# EAGLE schematic knxLayout (EAGLE 6.6.0)
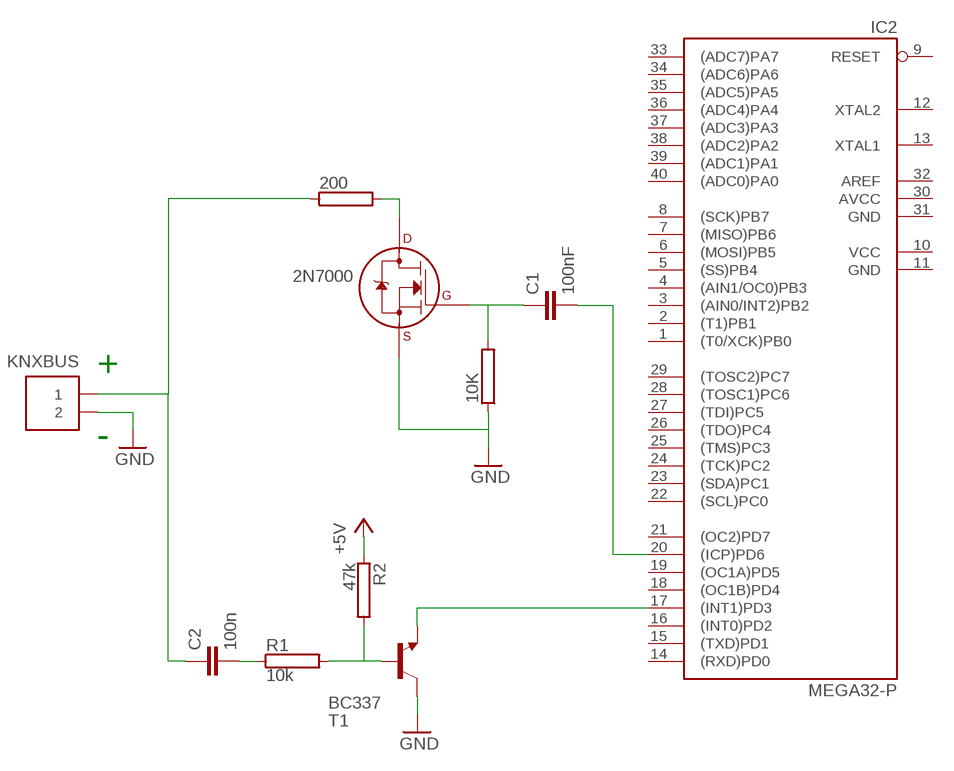
[diagram p0: schematic, sheet 1]

## Parts
2N7000  2N7000_SOT23  [SOT-23]
10K  RAC01  [AC01]
200  RAC01  [AC01]
C1  100nF  C2,5-3  [C2.5-3]
C2  100n  C2,5-3  [C2.5-3]
IC2  MEGA32-P  [DIL40]
KNXBUS  MKS1852-6-0-202  [MKS1852-6-0-202]
R1  10k  RAC01  [AC01]
R2  47k  RAC01  [AC01]
T1  BC337  [TO92]

## Nets
+5V: R2.1
GND: 2N7000.2(S) 10K.1 KNXBUS.2 T1.3(C)
N$1: R1.2 R2.2 T1.2(B)
N$2: C2.2 R1.1
N$3: IC2.17((INT1)PD3) T1.1(E)
N$4: 2N7000.1(G) 10K.2 C1.1
N$5: 2N7000.3(D) 200.2
N$7: 200.1 C2.1 KNXBUS.1
N$8: C1.2 IC2.20((ICP)PD6)
Unconnected: IC2.1((T0/XCK)PB0) IC2.2((T1)PB1) IC2.3((AIN0/INT2)PB2) IC2.4((AIN1/OC0)PB3) IC2.5((SS)PB4) IC2.6((MOSI)PB5) IC2.7((MISO)PB6) IC2.8((SCK)PB7) IC2.9(RESET) IC2.12(XTAL2) IC2.13(XTAL1) IC2.14((RXD)PD0) IC2.15((TXD)PD1) IC2.16((INT0)PD2) IC2.18((OC1B)PD4) IC2.19((OC1A)PD5) IC2.21((OC2)PD7) IC2.22((SCL)PC0) IC2.23((SDA)PC1) IC2.24((TCK)PC2) IC2.25((TMS)PC3) IC2.26((TDO)PC4) IC2.27((TDI)PC5) IC2.28((TOSC1)PC6) IC2.29((TOSC2)PC7) IC2.32(AREF) IC2.33((ADC7)PA7) IC2.34((ADC6)PA6) IC2.35((ADC5)PA5) IC2.36((ADC4)PA4) IC2.37((ADC3)PA3) IC2.38((ADC2)PA2) IC2.39((ADC1)PA1) IC2.40((ADC0)PA0)

## Notes on the sheet
- +
- -

## Power pins joined to a net without a drawn wire
AVCC: IC2.30(AVCC)
GND: IC2.11(GND) IC2.31(GND)
VCC: IC2.10(VCC)

## Library data of the parts
2N7000 = transistors:2N700*: 2N7000, 2N7002, NDS7002A N-channel enhancement mode MOSFET
10K 200 R1 R2 = resistor-power:R: Power Resitor; OC_FARNELL: unknown; OC_NEWARK: unknown
C1 C2 = capacitor-wima:C: CAPACITOR naming: grid - package width
IC2 = atmel:MEGA32-P: MICROCONTROLLER 32 Kbytes FLASH 2 Kbytes SRAM 1 Kbytes EEPROM USART 8-channel 10 bit ADC Source: www.atmel.com .. doc2503.pdf; MPN: ATMEGA32-16PU; OC_FARNELL: 1661729; OC_NEWARK: 51P1794
KNXBUS = con-stocko:MKS1852-6-0-202: Serie MKS 1850 Lötstifte In-line, Raster 2.5 mm, Stiftwannen, stehend, mit Rastlasche Source: http://www.stocko.de/de/index.php?seite=ka_rfk2_mks1850.html&rubrik=Katalog+-+RFK+2 rfk_1850.pdf; OC_FARNELL: unknown; OC_NEWARK: unknown
T1 = transistor:BC337: NPN TRANSISTOR